# EAGLE design BaseStation_ver_20 (EAGLE 5.11)

## Sheet 1 of 2
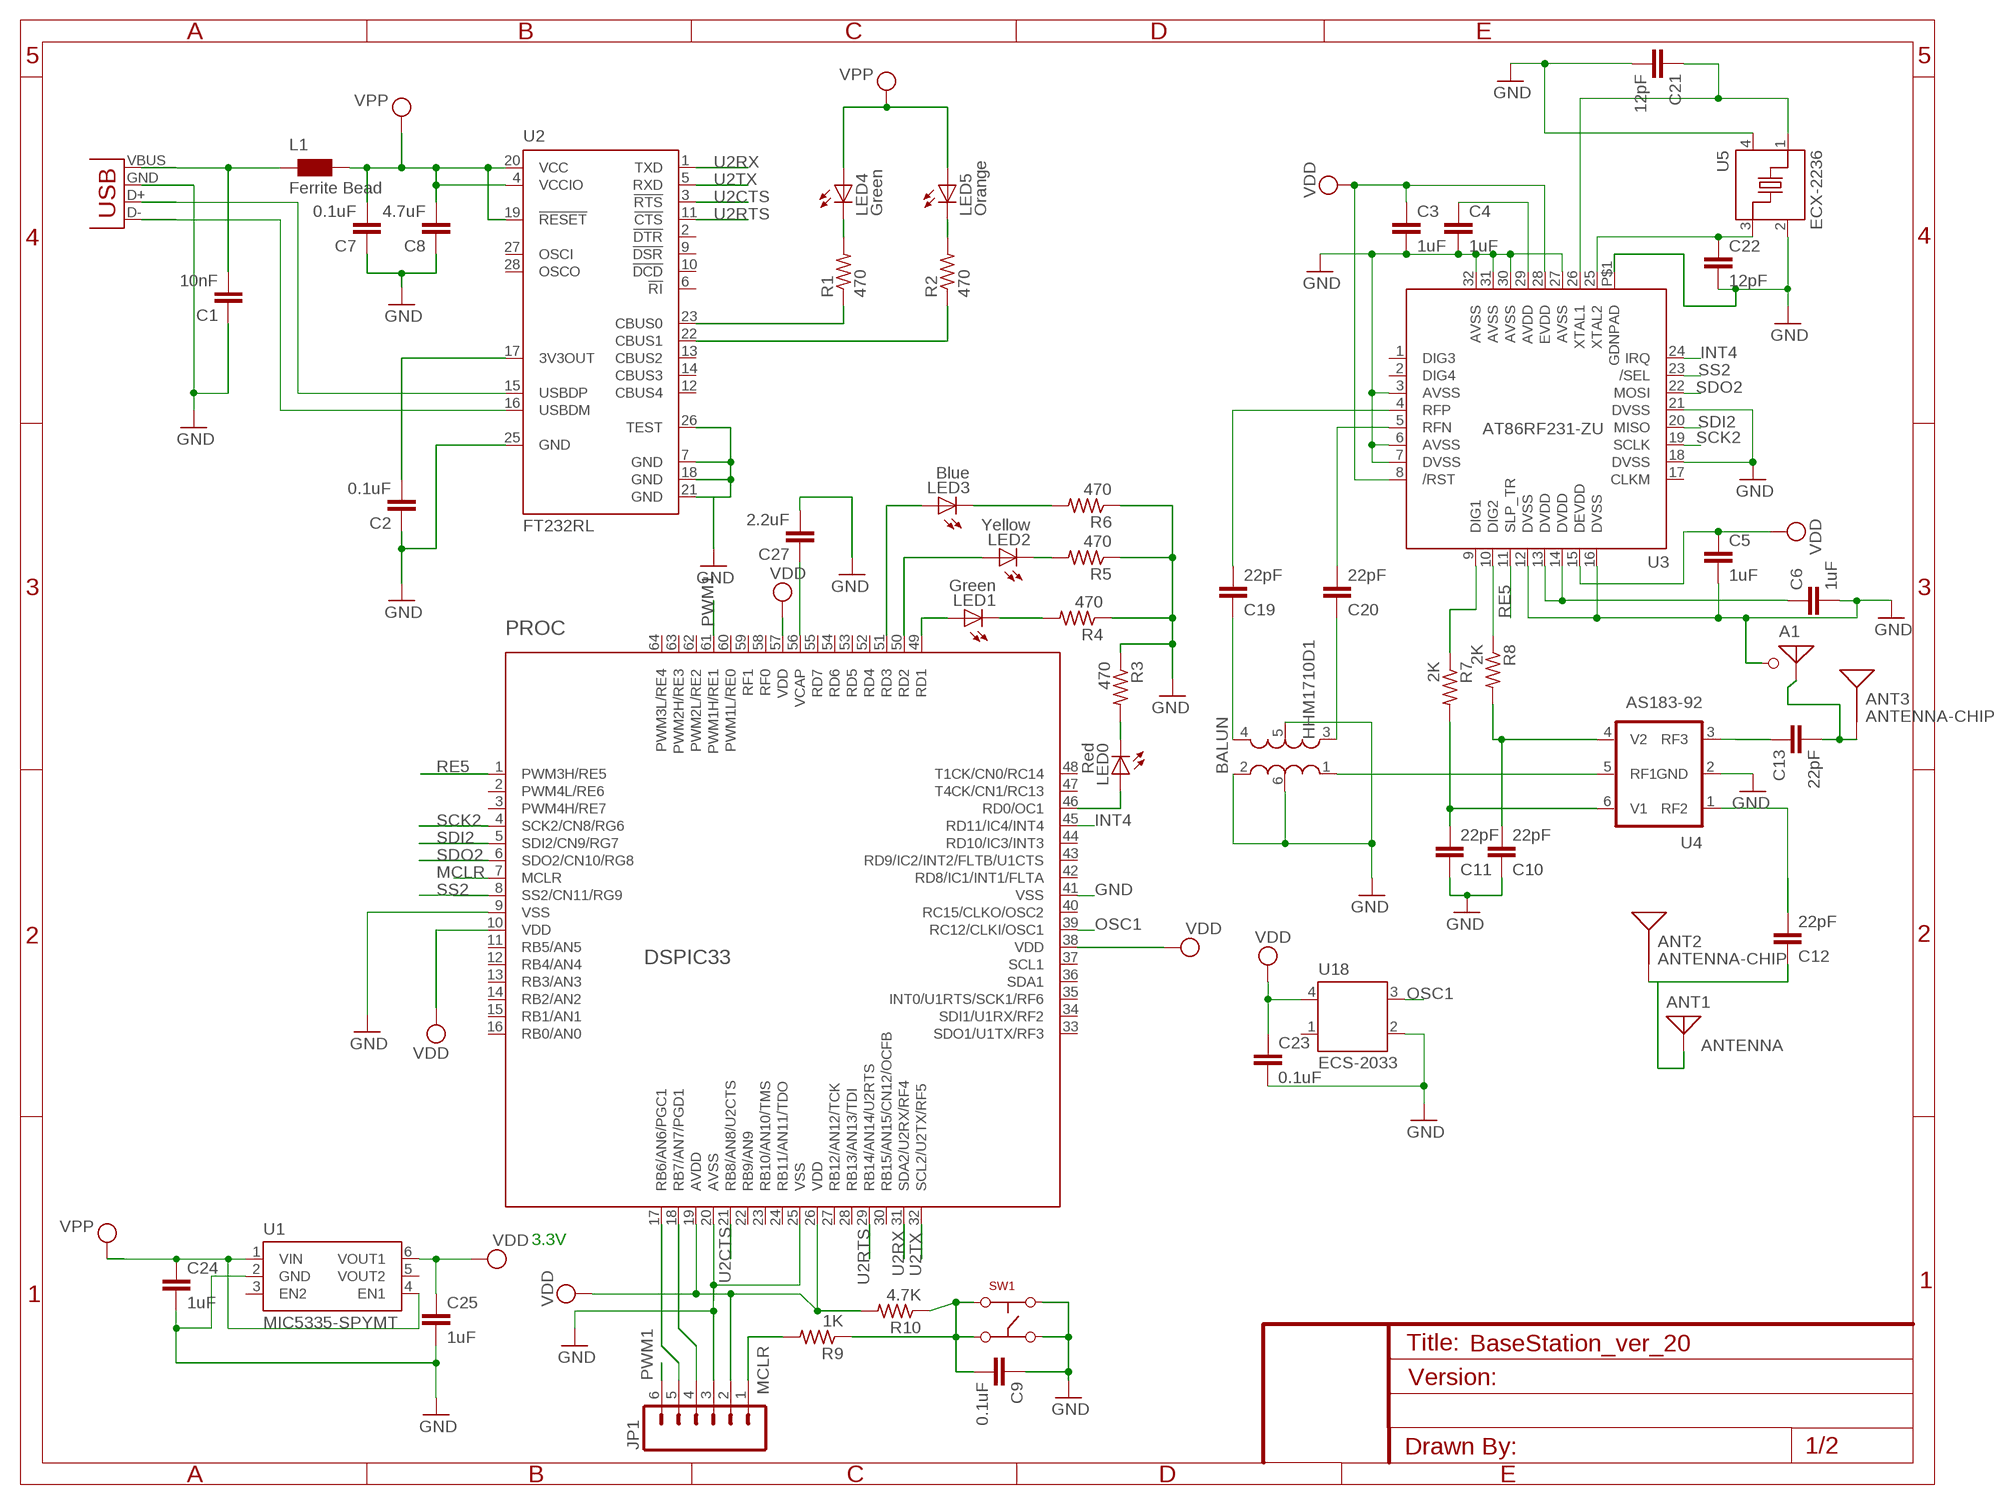
[diagram p0: schematic, sheet 1]

### Parts
A1  ANTENNA-U.FL  [U-FL]
ANT1  ANTENNA  [ANTENNA_PAD]
ANT2  ANTENNA-CHIP  [ANTENNA-CHIP]
ANT3  ANTENNA-CHIP  [ANTENNA-CHIP]
BALUN  HHM1710D1  BALUNA  [BALUN]
C1  10nF  CAP0402-CAP  [0402-CAP]
C2  0.1uF  CAP0402-CAP  [0402-CAP]
C3  1uF  CAP0402-CAP  [0402-CAP]
C4  1uF  CAP0402-CAP  [0402-CAP]
C5  1uF  CAP0402-CAP  [0402-CAP]
C6  1uF  CAP0402-CAP  [0402-CAP]
C7  0.1uF  CAP0402-CAP  [0402-CAP]
C8  4.7uF  CAP0402-CAP  [0402-CAP]
C9  0.1uF  CAP0402-CAP  [0402-CAP]
C10  22pF  CAP0402-CAP  [0402-CAP]
C11  22pF  CAP0402-CAP  [0402-CAP]
C12  22pF  CAP0402-CAP  [0402-CAP]
C13  22pF  CAP0402-CAP  [0402-CAP]
C19  22pF  CAP0402-CAP  [0402-CAP]
C20  22pF  CAP0402-CAP  [0402-CAP]
C21  12pF  CAP0402-CAP  [0402-CAP]
C22  12pF  CAP0402-CAP  [0402-CAP]
C23  0.1uF  CAP0402-CAP  [0402-CAP]
C24  1uF  CAP0402-CAP  [0402-CAP]
C25  1uF  CAP0402-CAP  [0402-CAP]
C27  2.2uF  CAP0402-CAP  [0402-CAP]
JP1  M06POLAR  [MOLEX-1X6]
L1  Ferrite Bead  WE-CBF_0805  [0805]
LED0  Red  LEDCHIP-LED0603  [CHIP-LED0603]
LED1  Green  LEDCHIP-LED0603  [CHIP-LED0603]
LED2  Yellow  LEDCHIP-LED0603  [CHIP-LED0603]
LED3  Blue  LEDCHIP-LED0603  [CHIP-LED0603]
LED4  Green  LEDCHIP-LED0603  [CHIP-LED0603]
LED5  Orange  LEDCHIP-LED0603  [CHIP-LED0603]
PROC  DSPIC33  DSPIC33FJ128MC706-I/PT  [TQFP64]
R1  470  R-US_R0402  [R0402]
R2  470  R-US_R0402  [R0402]
R3  470  R-US_R0402  [R0402]
R4  470  R-US_R0402  [R0402]
R5  470  R-US_R0402  [R0402]
R6  470  R-US_R0402  [R0402]
R7  2K  R-US_R0402  [R0402]
R8  2K  R-US_R0402  [R0402]
R9  1K  R-US_R0402  [R0402]
R10  4.7K  R-US_R0402  [R0402]
SW1  SWITCH-4TERMINAL  [PUSHBUTTON-SMD-4.7X3.5MM]
U1  MIC5335-SPYMT  MIC5320-JGYML  [MLF-6]
U2  FT232RL  [SSOP28]
U3  AT86RF231-ZU  [QFN-32]
U4  AS183-92  [SC-70-6]
U5  ECX-2236  CRYSTALS  [CRYSTAL-SMD]
U18  ECS-2033  OSCILLATORS  [OSCILLATOR-SMD]
X2  USB-A-H  [USB-A-H]

### Nets
ANT1: ANT1.P$1 ANT2.SIG(SIGNAL) C12.1
GND [sup]: A1.GND1(GND) BALUN.2(RFGND) BALUN.5(GND) BALUN.6(NC) C1.1 C2.1 C3.2 C4.2 C5.2 C6.2 C7.1 C8.1 C9.1 C10.1 C11.1 C21.2 C22.2 C23.2 C24.2 C25.2 C27.2 JP1.3 PROC.9(VSS) PROC.20(AVSS) PROC.25(VSS) PROC.41(VSS) R3.1 R4.1 R5.1 R6.1 SW1.1 SW1.2 U1.2(GND) U2.7(GND) U2.18(GND) U2.21(GND) U2.25(GND) U2.26(TEST) U3.3(AVSS) U3.6(AVSS) U3.7(DVSS) U3.12(DVSS) U3.16(DVSS) U3.18(DVSS) U3.21(DVSS) U3.27(AVSS) U3.30(AVSS) U3.31(AVSS) U3.32(AVSS) U3.P$1(GDNPAD) U4.2(GND) U5.2(GND) U5.4(GND) U18.2(GND) X2.GND(VBUS)
INT4: PROC.45(RD11/IC4/INT4) U3.24(IRQ)
MCLR: JP1.1 PROC.7(MCLR) R9.2
N$1: C27.1 PROC.56(VCAP)
N$2: C1.2 L1.1 X2.VBUS(GND)
N$3: LED3.C R6.2
N$4: R1.1 U2.23(CBUS0)
N$6: C10.2 R8.2 U4.4(V2)
N$7: LED1.C R4.2
N$8: JP1.5 PROC.17(RB6/AN6/PGC1)
N$9: A1.SIG ANT3.SIG(SIGNAL) C13.2
N$10: R2.1 U2.22(CBUS1)
N$11: LED1.A PROC.49(RD1)
N$12: LED4.C R1.2
N$13: R8.1 U3.10(DIG2)
N$14: U2.16(USBDM) X2.D-(D+)
N$15: U2.15(USBDP) X2.D+(D-)
N$16: C11.2 R7.2 U4.6(V1)
N$17: R7.1 U3.9(DIG1)
N$18: C13.1 U4.3(RF3)
N$19: C12.2 U4.1(RF2)
N$20: LED3.A PROC.51(RD3)
N$21: JP1.4 PROC.18(RB7/AN7/PGD1)
N$22: LED2.A PROC.50(RD2)
N$23: C4.1 U3.29(AVDD)
N$24: LED5.C R2.2
N$25: C9.2 R9.1 R10.1 SW1.3 SW1.4
N$26: LED2.C R5.2
N$27: C2.2 U2.17(3V3OUT)
N$28: C6.1 U3.13(DVDD) U3.14(DVDD)
N$29: LED0.A PROC.46(RD0/OC1)
N$30: LED0.C R3.2
N$39: BALUN.1(UNBAL) U4.5(RF1)
N$43: BALUN.4(BAL4) C19.1
N$46: BALUN.3(BAL3) C20.1
N$47: C19.2 U3.4(RFP)
N$49: C20.2 U3.5(RFN)
N$50: C22.1 U3.25(XTAL2) U5.3(IN/OUT)
N$51: C21.1 U3.26(XTAL1) U5.1(IN/OUT)
OSC1: PROC.39(RC12/CLKI/OSC1) U18.3(OUT)
PWM1: JP1.6 PROC.61(PWM1H/RE1)
RE5: PROC.1(PWM3H/RE5) U3.11(SLP_TR)
SCK2: PROC.4(SCK2/CN8/RG6) U3.19(SCLK)
SDI2: PROC.5(SDI2/CN9/RG7) U3.20(MISO)
SDO2: PROC.6(SDO2/CN10/RG8) U3.22(MOSI)
SS2: PROC.8(SS2/CN11/RG9) U3.23(/SEL)
U2CTS: PROC.21(RB8/AN8/U2CTS) U2.3(!RTS)
U2RTS: PROC.29(RB14/AN14/U2RTS) U2.11(!CTS)
U2RX: PROC.31(SDA2/U2RX/RF4) U2.1(TXD)
U2TX: PROC.32(SCL2/U2TX/RF5) U2.5(RXD)
VDD: C3.1 C5.1 C23.1 C25.1 JP1.2 PROC.10(VDD) PROC.19(AVDD) PROC.26(VDD) PROC.38(VDD) PROC.57(VDD) R10.2 U1.6(VOUT1) U3.8(/RST) U3.15(DEVDD) U3.28(EVDD) U18.4(VDD)
VPP: C7.2 C8.2 C24.1 L1.2 LED4.A LED5.A U1.1(VIN) U1.4(EN1) U2.4(VCCIO) U2.19(!RESET) U2.20(VCC)
Unconnected: PROC.2(PWM4L/RE6) PROC.3(PWM4H/RE7) PROC.11(RB5/AN5) PROC.12(RB4/AN4) PROC.13(RB3/AN3) PROC.14(RB2/AN2) PROC.15(RB1/AN1) PROC.16(RB0/AN0) PROC.22(RB9/AN9) PROC.23(RB10/AN10/TMS) PROC.24(RB11/AN11/TDO) PROC.27(RB12/AN12/TCK) PROC.28(RB13/AN13/TDI) PROC.30(RB15/AN15/CN12/OCFB) PROC.33(SDO1/U1TX/RF3) PROC.34(SDI1/U1RX/RF2) PROC.35(INT0/U1RTS/SCK1/RF6) PROC.36(SDA1) PROC.37(SCL1) PROC.40(RC15/CLKO/OSC2) PROC.42(RD8/IC1/INT1/FLTA) PROC.43(RD9/IC2/INT2/FLTB/U1CTS) PROC.44(RD10/IC3/INT3) PROC.47(T4CK/CN1/RC13) PROC.48(T1CK/CN0/RC14) PROC.52(RD4) PROC.53(RD5) PROC.54(RD6) PROC.55(RD7) PROC.58(RF0) PROC.59(RF1) PROC.60(PWM1L/RE0) PROC.62(PWM2L/RE2) PROC.63(PWM2H/RE3) PROC.64(PWM3L/RE4) U1.3(EN2) U1.5(VOUT2) U2.2(!DTR) U2.6(!RI) U2.9(!DSR) U2.10(!DCD) U2.12(CBUS4) U2.13(CBUS2) U2.14(CBUS3) U2.27(OSCI) U2.28(OSCO) U3.1(DIG3) U3.2(DIG4) U3.17(CLKM) U18.1(NC)

### Notes on the sheet
- 3.3V

## Sheet 2 of 2

## Library data of the parts
A1 = stan:ANTENNA-U.FL
ANT1 = stan:ANTENNA
ANT2 ANT3 = stan:ANTENNA-CHIP
BALUN = stan:BALUN
C1-C13 C19-C25 C27 = SparkFun:CAP: Capacitor Standard 0603 ceramic capacitor, and 0.1" leaded capacitor.
JP1 = SparkFun:M06: Header 6 Standard 6-pin 0.1" header. Use with straight break away headers (SKU : PRT-00116), right angle break away headers (PRT-00553), swiss pins (PRT-00743), machine pins (PRT-00117), and female headers (PRT-00115). Molex polarized connector foot print use with SKU : PRT-08094 with associated crimp pins and housings. NOTES ON THE VARIANTS LOCK and LOCK_LONGPADS... This footprint was designed to help hold the alignment of a through-hole component (i.e. 6-pin header) while soldering it into place. You may notice that each hole has been shifted either up or down by 0.005 of an inch from it's more standard position (which is a perfectly straight line). This slight alteration caused the pins (the squares in the middle) to touch the edges of the holes. Because they are alternating, it causes a "brace" to hold the component in place. 0.005 has proven to be the perfect amount of "off-center" position when using our standard breakaway headers. Although looks a little odd when you look at the bare footprint, once you have a header in there, the alteration is very hard to notice. Also, if you push a header all the way into place, it is covered up entirely on the bottom side. This idea of altering the position of holes to aid alignment will be further integrated into the Sparkfun Library for other footprints. It can help hold any component with 3 or more connection pins.
L1 = wuerth-elektronik:WE-CBF: SMD EMI Suppression Ferrite Beads - excellent anti-EMI properties - low DCR - impedances till 3000 ohms - rated current up to 6 A
LED0 LED1-LED5 = led:LED: LED OSRAM: - CHIPLED LG R971, LG N971, LY N971, LG Q971, LY Q971, LO R971, LY R971 LH N974, LH R974 LS Q976, LO Q976, LY Q976 LO Q996 - Hyper CHIPLED LW Q18S LB Q993, LB Q99A, LB R99A - SideLED LS A670, LO A670, LY A670, LG A670, LP A670 LB A673, LV A673, LT A673, LW A673 LH A674 LY A675 LS A676, LA A676, LO A676, LY A676, LW A676 LS A679, LY A679, LG A679 - Hyper Micro SIDELED® LS Y876, LA Y876, LO Y876, LY Y876 LT Y87S - SmartLED LW L88C, LW L88S LB L89C, LB L89S, LG L890 LS L89K, LO L89K, LY L89K LS L896, LA L896, LO L896, LY L896 - TOPLED LS T670, LO T670, LY T670, LG T670, LP T670 LSG T670, LSP T670, LSY T670, LOP T670, LYG T670 LG T671, LOG T671, LSG T671 LB T673, LV T673, LT T673, LW T673 LH T674 LS T676, LA T676, LO T676, LY T676, LB T676, LH T676, LSB T676, LW T676 LB T67C, LV T67C, LT T67C, LS T67K, LO T67K, LY T67K, LW E67C LS E67B, LA E67B, LO E67B, LY E67B, LB E67C, LV E67C, LT E67C LW T67C LS T679, LY T679, LG T679 LS T770, LO T770, LY T770, LG T770, LP T770 LB T773, LV T773, LT T773, LW T773 LH T774 LS E675, LA E675, LY E675, LS T675 LS T776, LA T776, LO T776, LY T776, LB T776 LHGB T686 LT T68C, LB T68C - Hyper Mini TOPLED® LB M676 - Mini TOPLED Santana® LG M470 LS M47K, LO M47K, LY M47K Source: http://www.osram.convergy.de LUXEON: - LUMILED® LXK2-PW12-R00, LXK2-PW12-S00, LXK2-PW14-U00, LXK2-PW14-V00 LXK2-PM12-R00, LXK2-PM12-S00, LXK2-PM14-U00 LXK2-PE12-Q00, LXK2-PE12-R00, LXK2-PE12-S00, LXK2-PE14-T00, LXK2-PE14-U00 LXK2-PB12-K00, LXK2-PB12-L00, LXK2-PB12-M00, LXK2-PB14-N00, LXK2-PB14-P00, LXK2-PB14-Q00 LXK2-PR12-L00, LXK2-PR12-M00, LXK2-PR14-Q00, LXK2-PR14-R00 LXK2-PD12-Q00, LXK2-PD12-R00, LXK2-PD12-S00 LXK2-PH12-R00, LXK2-PH12-S00 LXK2-PL12-P00, LXK2-PL12-Q00, LXK2-PL12-R00 Source: www.luxeon.com KINGBRIGHT: KA-3528ASYC Source: www.kingbright.com
PROC = stan:DSPIC33FJ128MC706: Microchip dsPIC33FJ128MC706
R1-R10 = rcl:R-US_: RESISTOR, American symbol
SW1 = stan:SWITCH-4TERMINAL
U1 = stan:MIC5320: MIC5320 High Performance Dual 150mA Voltage Regulator Package: NOT VERIFIED
U2 = ftdichip:FT232R: Source: http://www.ftdichip.com/Documents/DataSheets/DS_FT232R_v104.pdf
U3 = stan:AT86RF231: Atmel 2.4GHz transceiver for Zigbee
U4 = stan:AS183-92
U5 = stan:CRYSTAL
U18 = stan:OSCILLATOR
X2 = SparkFun:USB: USB Connectors USB-B-PTH is fully proven SKU : PRT-00139 USB-miniB is fully proven SKU : PRT-00587 USB-A-PCB is untested. USB-A-H is throughly reviewed, but untested. Spark Fun Electronics SKU : PRT-00437 USB-B-SMT is throughly reviewed, but untested. Needs silkscreen touching up. USB-A-S has not been used/tested USB-MB-H has not been used/tested

## Net classes
1 sup: width 0.254 mm

## Board
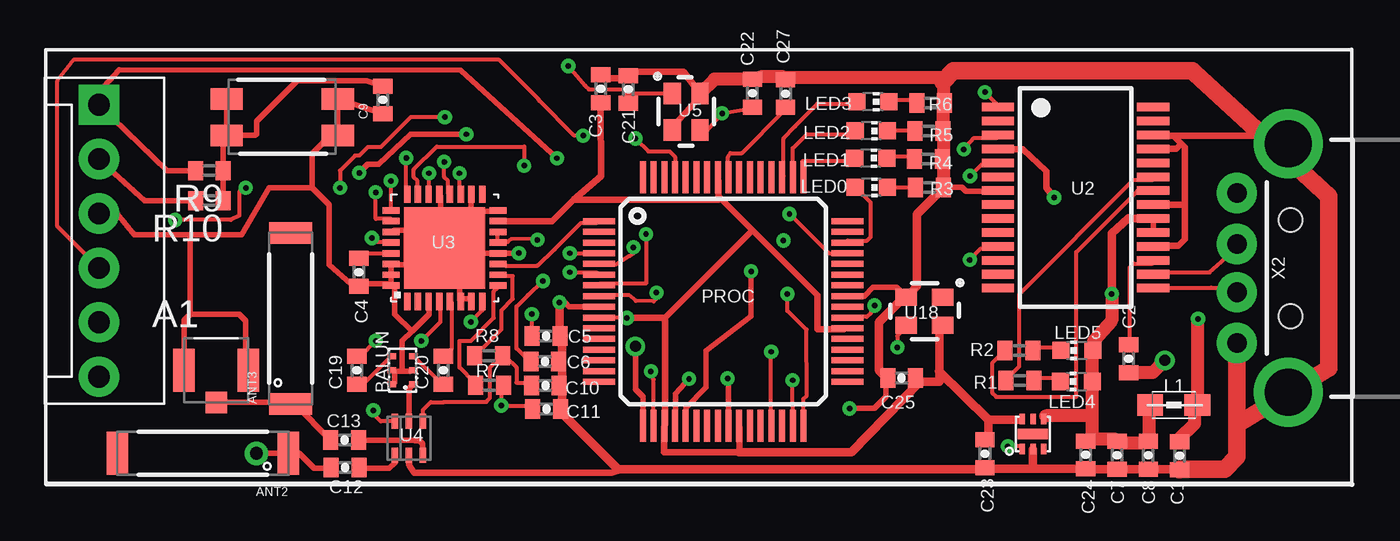
[diagram p1: board, top side]
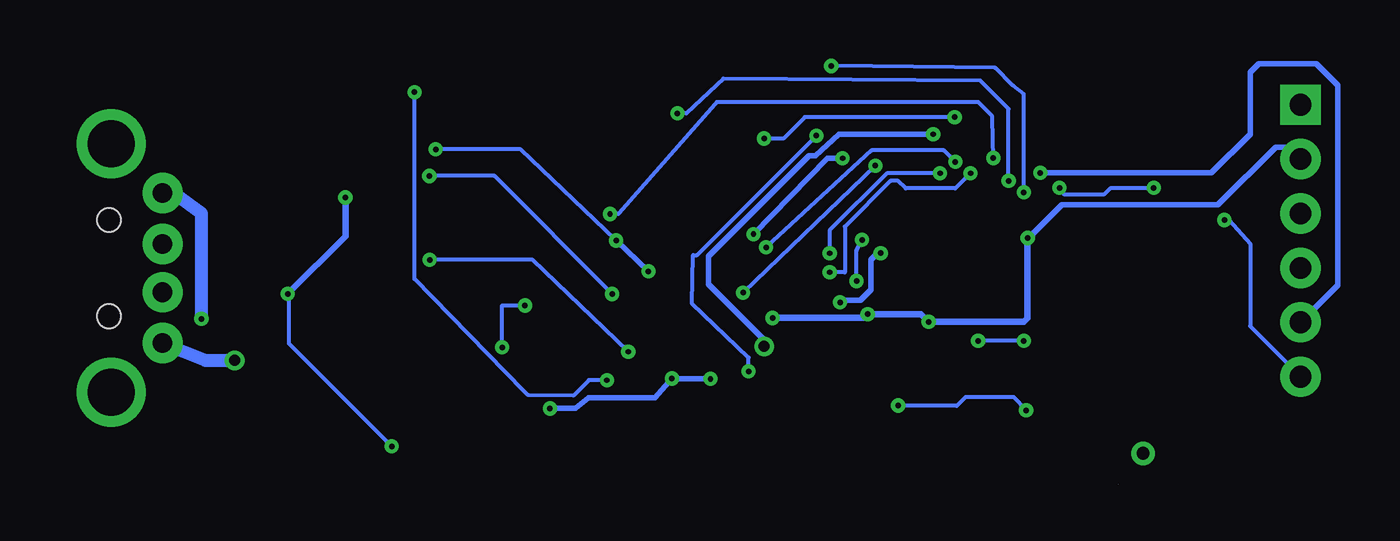
[diagram p2: board, bottom side, seen from below]

Size 0.01 x 0 mm. Coordinates in mm from the lower left corner, seen from the top.
Outline: 0.01,0 0,0
Copper layers (1*16): Top 0.035mm / dielectric 1.5mm / Bottom 0.035mm
Design rules "default *": minimum track width 7mil, minimum drill 10mil, track to track 6mil, track to pad 6mil, pad to pad 6mil, via to via 6mil, smd to smd 6mil, copper to edge 6mil, drill to drill 6mil, minimum pad ring 10mil, minimum via ring 8mil, stop-mask expansion 4mil, vias tented up to drill 27mil, thermal gap 10mil

### Footprints (pad centres in the part's own frame; a part is rotated, then mirrored left to right if it is on the bottom)
U-FL = smd 1 x 2: GND1 -1.5,0; GND2 1.5,0 | smd 1 x 1: SIG 0,-1.5
ANTENNA_PAD = drill 0.6 round: P$1 0,0
ANTENNA-CHIP = smd 1 x 2: NC 4,0; SIG -4,0
BALUN = smd 0.27 x 0.4: 1 -0.7,-0.5; 2 -0.05,-0.5; 3 0.6,-0.5; 4 0.6,0.5; 5 -0.05,0.5; 6 -0.7,0.5
0402-CAP = smd 0.7 x 0.9: 1 -0.65,0; 2 0.65,0
MOLEX-1X6 = drill 1.016 pad 1.88 square: 1 0,0 | drill 1.016 pad 1.88 round: 2 2.54,0; 3 5.08,0; 4 7.62,0; 5 10.16,0; 6 12.7,0
0805 = smd 1.2 x 1: 1 -1.1,0; 2 1.1,0
CHIP-LED0603 = smd 0.8 x 0.8: A 0,-0.75; C 0,0.75
TQFP64 = smd 1.5 x 0.28: 1 -5.8,3.75; 2 -5.8,3.25; 3 -5.8,2.75; 4 -5.8,2.25; 5 -5.8,1.75; 6 -5.8,1.25; 7 -5.8,0.75; 8 -5.8,0.25; 9 -5.8,-0.25; 10 -5.8,-0.75; 11 -5.8,-1.25; 12 -5.8,-1.75; 13 -5.8,-2.25; 14 -5.8,-2.75; 15 -5.8,-3.25; 16 -5.8,-3.75; 33 5.8,-3.75; 34 5.8,-3.25; 35 5.8,-2.75; 36 5.8,-2.25; 37 5.8,-1.75; 38 5.8,-1.25; 39 5.8,-0.75; 40 5.8,-0.25; 41 5.8,0.25; 42 5.8,0.75; 43 5.8,1.25; 44 5.8,1.75; 45 5.8,2.25; 46 5.8,2.75; 47 5.8,3.25; 48 5.8,3.75 | smd 0.28 x 1.5: 17 -3.75,-5.8; 18 -3.25,-5.8; 19 -2.75,-5.8; 20 -2.25,-5.8; 21 -1.75,-5.8; 22 -1.25,-5.8; 23 -0.75,-5.8; 24 -0.25,-5.8; 25 0.25,-5.8; 26 0.75,-5.8; 27 1.25,-5.8; 28 1.75,-5.8; 29 2.25,-5.8; 30 2.75,-5.8; 31 3.25,-5.8; 32 3.75,-5.8; 49 3.75,5.8; 50 3.25,5.8; 51 2.75,5.8; 52 2.25,5.8; 53 1.75,5.8; 54 1.25,5.8; 55 0.75,5.8; 56 0.25,5.8; 57 -0.25,5.8; 58 -0.75,5.8; 59 -1.25,5.8; 60 -1.75,5.8; 61 -2.25,5.8; 62 -2.75,5.8; 63 -3.25,5.8; 64 -3.75,5.8
R0402 = smd 0.7 x 0.9: 1 -0.65,0; 2 0.65,0
PUSHBUTTON-SMD-4.7X3.5MM = smd 1.5 x 1: 1 2.6,0.85; 2 2.6,-0.85; 3 -2.6,0.85; 4 -2.6,-0.85
MLF-6 = smd 0.25 x 0.5: 1 -0.5,-0.7; 2 0,-0.7; 3 0.5,-0.7; 4 0.5,0.7; 5 0,0.7; 6 -0.5,0.7 | smd 1.4 x 0.5: P$1 0,0
SSOP28 = smd 0.4 x 1.5: 1 -4.225,-3.625; 2 -3.575,-3.625; 3 -2.925,-3.625; 4 -2.275,-3.625; 5 -1.625,-3.625; 6 -0.975,-3.625; 7 -0.325,-3.625; 8 0.325,-3.625; 9 0.975,-3.625; 10 1.625,-3.625; 11 2.275,-3.625; 12 2.925,-3.625; 13 3.575,-3.625; 14 4.225,-3.625; 15 4.225,3.625; 16 3.575,3.625; 17 2.925,3.625; 18 2.275,3.625; 19 1.625,3.625; 20 0.975,3.625; 21 0.325,3.625; 22 -0.325,3.625; 23 -0.975,3.625; 24 -1.625,3.625; 25 -2.275,3.625; 26 -2.925,3.625; 27 -3.575,3.625; 28 -4.225,3.625
QFN-32 = smd 0.8 x 0.3: 1 -2.5,1.75; 2 -2.5,1.25; 3 -2.5,0.75; 4 -2.5,0.25; 5 -2.5,-0.25; 6 -2.5,-0.75; 7 -2.5,-1.25; 8 -2.5,-1.75; 17 2.5,-1.75; 18 2.5,-1.25; 19 2.5,-0.75; 20 2.5,-0.25; 21 2.5,0.25; 22 2.5,0.75; 23 2.5,1.25; 24 2.5,1.75 | smd 0.3 x 0.8: 9 -1.75,-2.5; 10 -1.25,-2.5; 11 -0.75,-2.5; 12 -0.25,-2.5; 13 0.25,-2.5; 14 0.75,-2.5; 15 1.25,-2.5; 16 1.75,-2.5; 25 1.75,2.5; 26 1.25,2.5; 27 0.75,2.5; 28 0.25,2.5; 29 -0.25,2.5; 30 -0.75,2.5; 31 -1.25,2.5; 32 -1.75,2.5 | smd 3.8 x 3.8: P$1 0,0.001
SC-70-6 = smd 0.3 x 0.7: 1 -0.65,-0.8; 2 0,-0.8; 3 0.65,-0.8; 4 0.65,0.8; 5 0,0.8; 6 -0.65,0.8
CRYSTAL-SMD = smd 1 x 0.8: 1 -0.85,-0.65; 2 0.85,-0.65; 3 0.85,0.65; 4 -0.85,0.65
OSCILLATOR-SMD = smd 1 x 0.8: 1 -0.85,-0.65; 2 0.85,-0.65; 3 0.85,0.65; 4 -0.85,0.65
USB-A-H = drill 0.914 pad 1.88 round: D+ 2.4,1.127; D- 2.4,-1.127; GND 2.4,3.5; VBUS 2.4,-3.5 | drill 2.2 round: GND2 0,-5.8; GND3 0,5.8 | hole 1.1: -0.1,2.25; -0.1,-2.25

### Placement (x,y rotation side)
A1  -3.03,5.33 0 top  (outside the outline)
ANT1  -1.15,1.45 0 top
ANT2  -3.65,1.45 180 top
ANT3  0.45,7.75 90 top  (outside the outline)
BALUN  5.67,5.38 90 top  (outside the outline)
C1  41.96,1.34 90 top  (outside the outline)
C2  39.58,5.87 90 top  (outside the outline)
C3  14.92,18.48 90 top  (outside the outline)
C4  3.63,9.91 270 top  (outside the outline)
C5  12.37,6.93 0 top  (outside the outline)
C6  12.32,5.74 0 top  (outside the outline)
C7  39.05,1.37 90 top  (outside the outline)
C8  40.5,1.36 90 top  (outside the outline)
C9  4.75,17.95 90 top  (outside the outline)
C10  12.34,4.63 180 top  (outside the outline)
C11  12.39,3.53 180 top  (outside the outline)
C12  2.99,0.8 0 top
C13  2.97,2.07 180 top
C19  3.54,5.33 90 top  (outside the outline)
C20  7.58,5.33 90 top  (outside the outline)
C21  16.21,18.44 90 top  (outside the outline)
C22  22.01,18.27 90 top  (outside the outline)
C23  32.87,1.44 270 top  (outside the outline)
C24  37.58,1.38 270 top  (outside the outline)
C25  28.98,4.97 180 top  (outside the outline)
C27  23.56,18.25 90 top  (outside the outline)
JP1  -8.51,17.73 270 top  (outside the outline)
L1  41.69,3.71 180 top  (outside the outline)
LED0  27.56,13.87 270 top  (outside the outline)
LED1  27.54,15.23 270 top  (outside the outline)
LED2  27.56,16.51 270 top  (outside the outline)
LED3  27.64,17.87 270 top  (outside the outline)
LED4  37.14,4.81 90 top  (outside the outline)
LED5  37.16,6.26 90 top  (outside the outline)
PROC  20.65,8.54 0 top  (outside the outline)
R1  34.5,4.85 0 top  (outside the outline)
R2  34.46,6.25 0 top  (outside the outline)
R3  30.28,13.87 180 top  (outside the outline)
R4  30.23,15.2 180 top  (outside the outline)
R5  30.25,16.5 180 top  (outside the outline)
R6  30.34,17.81 180 top  (outside the outline)
R7  9.73,4.63 0 top  (outside the outline)
R8  9.7,6.01 0 top  (outside the outline)
R9  -3.35,14.65 180 top  (outside the outline)
R10  -3.35,13.25 180 top  (outside the outline)
SW1  0.05,17.15 0 top  (outside the outline)
U1  35.11,2.35 0 top  (outside the outline)
U2  37.1,13.39 270 top  (outside the outline)
U3  7.64,11.04 90 top  (outside the outline)
U4  5.97,2.16 0 top  (outside the outline)
U5  18.92,17.41 270 top  (outside the outline)
U18  30.05,8.09 180 top  (outside the outline)
X2  47.04,10.1 180 top  (outside the outline)

### Tracks (layer width: path | path; a pad name or v marks a point on that pad's centre or on a via)
ANT1
  Top 0.254: ANT1.P$1 ANT2.SIG 0.85,1.45 1.55,0.75 2.3,0.75 C12.1
GND  (via drill 0.25, 0.51)
  Top 0.254: 40.54,0.71 C8.1 40.36,0.71 | 41.78,0.71 C1.1 | C7.1 39.12,0.71 | C24.2 | U18.2 29.16,8.81 | 28.27,4.98 C25.2 28.25,4.8 28.25,4.09 27.72,3.56 27.36,3.56 v26.55,3.55 | 30.94,15.29 R4.1 | R5.1 30.94,16.36 | 30.76,13.69 30.76,13.87 R3.1 31.09,13.87 31.81,13.87 31.98,13.69 33.41,13.69 U2.7 | 29.34,8.89 U18.2 | PROC.41 27.24,8.79 27.65,9.2 28.74,9.2 U18.2 | 16.21,19.28 C21.2 | 19.38,17.89 19.48,18.15 U5.4 | 18.31,16.72 U5.2 | C21.2 16.08,19.02 | 15.01,19.02 C3.2 15.09,18.97 | 22.4,19.02 C22.2 | 23.47,19.02 C27.2 23.65,19 | 30.9,17.72 R6.1 30.94,17.96 | 30.94,19 30.94,18.8 30.91,18.8 | v19.05,4.93 18.42,4.25 PROC.20 | PROC.25 20.9,3.39 20.9,4.9 v20.85,4.95 | C21.2 15.98,18.97 | 13.13,5.64 C6.2 13.13,5.82 | 13.13,4.75 C10.1 13.13,4.57 | C5.2 13.13,6.88 | 5.31,5.28 5.31,4.75 BALUN.6 | 5.66,5.28 5.31,5.28 | 5.66,5.28 6.02,5.28 BALUN.2 | 5.31,5.28 BALUN.5 | 5.13,9.37 5.13,9.73 U3.31 5.13,9.91 5.13,10.26 U3.30 5.31,10.26 5.84,10.26 5.84,11.86 | 5.66,5.28 5.66,6.71 6.11,7.15 | 6.11,7.15 6.91,7.95 6.91,8.48 U3.3 | 5.13,9.37 3.71,9.37 C4.2 | 5.13,9.37 U3.32 5.31,9.2 5.31,7.95 6.11,7.15 | 13.13,3.33 13.13,3.68 C11.1 12.95,3.33 | 32.79,0.71 C23.2 | C4.2 3.35,9.2 | v11.09,10.79 U3.12 10.11,10.8 8.33,10.8 | v13,8.5 13.25,8.5 13.45,8.3 PROC.9 | U3.7 8.86,8.66 8.51,8.66 U3.6 8.33,8.66 8.33,10.8 | 7.44,11.86 7.62,11.86 7.62,11.68 | 5.84,11.86 7.44,11.86 | 5.84,11.86 5.31,11.86 U3.27 | 7.62,11.68 7.62,11.15 U3.P$1 | 7.44,11.86 7.44,13.46 U3.21 | 7.44,11.86 U3.P$1 | 7.62,11.68 8.86,12.93 8.86,13.46 U3.18 | U3.P$1 7.62,11.68 | U3.16 10.11,12.75 8.86,12.75 U3.P$1 | 8.33,10.8 8.33,11.86 U3.P$1 | 5.84,11.86 U3.P$1 | U3.P$1 8.33,10.8 | 40.74,16.29 U2.26 | C4.2 3.53,9.37 3.24,9.36 2.25,10.25 2.24,13.06 1.45,13.85
  Top 0.254: C9.1 SW1.1 SW1.2 2.65,16.65 1.45,15.45 1.45,13.85 | JP1.3 -7.65,12.65 -6.85,11.65 -4.25,11.65 | -4.25,11.65 -1.85,11.65 -0.55,13.85 1.45,13.85 | A1.GND1 -4.53,7.67 -4.25,7.95 | -1.65,5.35 -1.65,7.65 -1.95,7.95 -4.25,7.95 | -4.25,7.95 -4.25,11.65
  Top 0.305: C23.2 32.93,0.73 | 19.38,17.89 18.31,16.72 | 15.98,18.97 15.09,18.97 | 16.21,19.28 18.8,19.28 U5.4 | 41.67,16.29 45.69,16.29 48.92,13.46 | 41.67,16.29 40.74,16.29 | 41.67,16.29 42.05,15.9 | 42.05,15.9 42.2,15.75 42.2,13.1 | 42.2,13.1 42.2,11.45 41.9,11.15 40.76,11.15 U2.18 | U2.21 42.17,13.06 42.2,13.1 | U2.25 41.81,15.66 42.05,15.9 | 15.95,0.71 15.44,0.56 6.2,0.56 6.02,0.84 5.98,0.92 U4.2
  Top 0.406: 40.54,0.71 41.78,0.71 | 39.12,0.71 40.36,0.71 | C24.2 C7.1 | 35.1,0.73 C24.2 | U1.2 35.11,0.74 35.1,0.73 | 32.93,0.73 35.1,0.73 | 29.16,8.81 27.92,7.57 27.92,5.33 28.27,4.98 | 29.34,8.89 29.69,9.25 29.69,12.62 30.76,13.69 | R4.1 30.93,15.15 | 13.13,5.64 13.13,4.75 | 13.13,6.88 13.13,5.82 | 13.13,4.57 13.13,3.68 | 13.13,3.33 15.75,0.71 15.95,0.71 32.79,0.71 | v11.09,10.79 v11.1,10.8 | v13,8.5 13,6.95 C5.2
  Top 0.61: 30.94,16.36 30.94,15.29 | 23.47,19.02 22.4,19.02 | 30.9,17.72 R5.1 | 30.93,15.15 R3.1 | 30.94,19 23.65,19 | 30.94,18.8 30.94,17.96 | C22.2 20.23,18.92 U5.4 | C2.1 40.7,5.22 v41.27,5.79 | 42.68,19.2 42.55,19.31
  Top 0.813: 30.91,18.8 31.4,19.31 42.55,19.31 | 44.64,2.78 44.64,1.28 44.07,0.71 41.98,0.71 C1.1 | 44.64,2.78 X2.GND | 42.68,19.2 48.92,13.46 48.92,5.43 44.64,2.78
  Bottom 0.254: 11.25,10.8 11.55,10.5 11.55,9.1 12.05,8.6 12.9,8.6 | v19.05,4.93 20.83,4.93 v20.85,4.95 21.65,4.05 24.75,4.05 25.35,3.55 v26.55,3.55
  Bottom 0.406: v11.1,10.8 11.25,10.8 | 12.9,8.6 v13,8.5
  Bottom 0.61: v41.27,5.79 42.63,5.79 X2.GND
INT4  (via drill 0.25)
  Top 0.178: v5.84,15.24 5.84,13.64 U3.24 | v23.74,12.63 25.58,10.8 26.29,10.8 PROC.45
  Bottom 0.178: v5.84,15.24 5.89,17.07 5.89,17.19 6.55,17.85 18.75,17.85 18.85,17.75 19.53,16.97 23.35,12.63 v23.74,12.63
MCLR  (via drill 0.25)
  Top 0.178: v17.04,11.68 17.04,9.37 14.91,9.37 PROC.7
  Top 0.254: v12.89,15.23 8.37,19.33 -7.56,19.36 -8.51,18.31 JP1.1 -5.33,14.65 R9.2
  Bottom 0.254: v17.04,11.68 13.6,15.23 v12.89,15.23
N$1
  Top 0.178: C27.1 23.47,17.42 21.51,15.47 20.98,15.47 20.88,15.3 PROC.56
N$2  (via drill 0.25)
  Top 0.178: C1.2 41.96,2.13 | 42.67,3.56 L1.1 42.82,3.86
  Top 0.61: 41.96,2.13 42.67,2.85 42.67,3.56 | 42.82,3.86 v42.82,7.73
  Bottom 0.61: v42.82,7.73 42.82,12.66 44.02,13.56 X2.VBUS
N$3
  Top 0.178: LED3.C 28.43,17.96 29.67,17.96 R6.2
N$4
  Top 0.178: R1.1 33.94,4.98 34.47,5.51 34.47,8.89 39.81,14.22 40.7,14.22 U2.23
N$6
  Top 0.178: C10.2 11.53,4.75 11,4.75 11,5.46 10.46,6 R8.2 10.29,6 9.75,5.46 9.75,4.04 9.57,3.86 7.62,3.86 7.61,3.85 6.99,3.85 6.62,3.48 U4.4
N$7
  Top 0.178: LED1.C 28.43,15.29 29.49,15.29 R4.2
N$8  (via drill 0.25, 0.51)
  Top 0.254: PROC.17 16.9,4.1 16.55,4.45 v16.55,6.45 | v8.65,16.35 6.05,16.35 4.55,14.95 4.05,14.95 v3.65,14.55
  Bottom 0.254: v16.55,6.45 16.55,6.75 19.15,9.35 19.15,10.65 14.45,15.35 14.15,15.35 13.05,16.35 v8.65,16.35 | v3.65,14.55 -4.35,14.55 -6.15,16.35 -6.15,19.25 -6.55,19.65 -9.25,19.65 -10.25,18.65 -10.25,9.31 JP1.5
N$9
  Top 0.254: C13.2 0.64,3.75 ANT3.SIG 0.37,3.83 A1.SIG
N$10
  Top 0.178: R2.1 33.76,6.22 33.23,5.69 33.23,4.27 33.41,4.09 37.14,4.09 37.14,10.85 39.98,13.69 40.7,13.69 U2.22
N$11
  Top 0.178: LED1.A 26.67,15.11 24.36,15.11 24.36,14.4 PROC.49
N$12
  Top 0.178: LED4.C 36.25,4.98 35.18,4.98 R1.2
N$13
  Top 0.178: U3.10 10.29,9.73 10.82,9.73 10.82,8.66 10.29,8.13 10.29,7.24 9.22,6.17 R8.1
N$14
  Top 0.178: 40.87,9.78 U2.16 40.87,9.91 43.36,9.91 44.31,10.75 44.62,11.12 X2.D-
N$15
  Top 0.178: U2.15 40.87,9.2 43.42,9.2 44.37,9.18 X2.D+
N$16  (via drill 0.25)
  Top 0.178: v4.31,3.46 4.31,3.27 4.33,3.27 4.65,2.95 U4.6 | R7.2 10.29,4.57 v10.29,3.68 11.71,3.68 C11.2
  Bottom 0.178: v4.31,3.46 4.88,4.08 7.14,4.08 7.55,3.67 v10.29,3.68
N$17
  Top 0.178: U3.9 10.11,9.2 9.93,9.02 9.93,7.77 8.86,6.71 8.33,6.71 8.33,5.46 9.04,4.75 R7.1
N$18
  Top 0.178: 6.23,2.07 6.25,2.05 | U4.3
  Top 0.254: C13.1 6.23,2.07 | 6.25,2.05 6.46,2.05 6.62,1.89 U4.3
N$19
  Top 0.254: U4.1 5.32,1.02 5.05,0.75 3.79,0.75 C12.2
N$20
  Top 0.178: LED3.A 26.85,17.78 25.04,17.78 24.89,17.6 24,16.71 23.47,16.16 23.47,14.4 PROC.51
N$21  (via drill 0.25)
  Top 0.178: PROC.18 17.4,4.9 v17.27,5.28 | JP1.4 -10.45,12.05 -10.45,18.85 -9.65,19.85 10.15,19.85 12.02,17.98 12.06,17.91 13.69,16.28 v14.11,16.28
  Bottom 0.178: v17.27,5.28 17.27,5.92 19.91,8.43 19.86,10.71 19.69,10.71 v14.11,16.28
N$22
  Top 0.178: LED2.A 26.67,16.36 24.55,16.36 23.9,15.7 PROC.50
N$23
  Top 0.178: U3.29 3.71,10.8 3.71,10.62 C4.1
N$24
  Top 0.178: LED5.C 36.25,6.4 35.18,6.4 R2.2
N$25
  Top 0.254: R9.1 R10.1 -2.7,16.55 SW1.4 | SW1.4 SW1.3 | SW1.4 -1.2,16.3 -1.15,16.35 -1.15,16.95 0.75,18.85 4,18.85 C9.2
N$26
  Top 0.178: LED2.C 28.43,16.54 29.49,16.54 R5.2
N$27
  Top 0.178: C2.2 39.63,6.58 39.63,10.13 39.81,10.31 40.7,10.31 U2.17
N$28  (via drill 0.25)
  Top 0.178: U3.14 10.11,11.68 10.11,11.33 U3.13 10.59,11.33 10.59,11.34 10.75,11.45 11.92,11.48 v11.97,11.42 | v12.23,9.5 11.53,8.84 11,8.31 11,6.35 11.53,5.82 C6.1
  Bottom 0.178: v12.23,9.5 12.23,10.92 v11.97,11.42
N$29
  Top 0.178: LED0.A 26.83,13.87 27.54,13.16 27.54,11.56 27.36,11.38 26.47,11.38 PROC.46
N$30
  Top 0.178: LED0.C 28.43,13.87 29.49,13.87 R3.2
N$39
  Top 0.254: U4.5 5.97,4.48 BALUN.1
N$43
  Top 0.178: BALUN.4 5.13,6 3.71,4.57 C19.1
N$46
  Top 0.178: BALUN.3 6.2,6 7.44,4.75 C20.1
N$47  (via drill 0.25)
  Top 0.178: v6.55,6.71 7.44,7.59 7.44,8.48 U3.4 | v4.42,6.71 3.71,6 C19.2
  Bottom 0.178: v4.42,6.71 v6.55,6.71
N$49
  Top 0.178: U3.5 7.97,8.48 7.97,6.35 7.62,6 C20.2
N$50  (via drill 0.25)
  Top 0.178: v5.13,14.17 5.13,12.93 U3.25 | U5.3 19.71,16.48 19.71,16.31 v20.6,17.32 21.84,17.55 C22.1
  Bottom 0.178: v5.13,14.17 5.13,17.53 6.45,18.85 18.45,18.95 20.18,17.32 v20.6,17.32
N$51  (via drill 0.25)
  Top 0.178: 18.23,18.32 U5.1 18.11,18.26 16.15,18.26 | v4.42,13.64 4.42,12.4 5.13,12.4 U3.26 | v13.41,19.54 14.2,18.62 14.38,18.44 16.15,18.44 16.15,18.26 | 16.15,18.26 16.15,17.91 C21.1
  Bottom 0.178: v4.42,13.64 4.42,18.22 4.92,18.62 5.75,19.45 v13.41,19.54
OSC1  (via drill 0.25)
  Top 0.178: v28.78,6.4 28.78,6.93 29.14,7.29 U18.3 | v27.72,8.36 27.54,8.18 27.54,8 27.36,7.82 26.47,7.82 PROC.39
  Bottom 0.178: v28.78,6.4 28.78,8.36 v27.72,8.36
PWM1  (via drill 0.25)
  Top 0.178: PROC.61 18.4,15.3 18.15,15.55 17.15,15.55 v16.55,16.15 | v7.65,17.15 6.05,17.15 4.65,15.75 4.05,15.75 3.65,15.35 3.45,15.35 2.75,14.65 v2.75,13.85 | v-1.65,13.85 -1.85,13.85 -1.95,13.65 -1.95,12.55 -2.35,12.35 v-4.95,12.35
  Bottom 0.178: v16.55,16.15 15.65,16.15 14.65,17.15 v7.65,17.15 | v2.75,13.85 2.75,13.75 2.55,13.55 0.65,13.55 0.35,13.85 v-1.65,13.85 | v-4.95,12.35 -5.15,12.35 -6.15,11.25 -6.15,7.39 JP1.6
RE5
  Top 0.178: U3.11 10.49,10.21 11.97,10.21 12.77,10.97 14.02,12.22 14.73,12.22 PROC.1
SCK2  (via drill 0.25)
  Top 0.178: v8.33,14.53 8.33,13.64 U3.19 | v13.49,10.8 14.73,10.8 PROC.4
  Bottom 0.178: v8.33,14.53 10.82,14.53 13.49,11.86 v13.49,10.8
SDI2  (via drill 0.25)
  Top 0.178: v7.62,15.06 7.62,14.35 7.8,14.17 7.8,13.64 U3.20 | v16.45,11.07 16.48,10.8 16.28,10.67 15.62,10.26 14.91,10.26 PROC.5
  Bottom 0.178: v7.62,15.06 8.15,15.6 11.53,15.6 v16.45,11.07
SDO2  (via drill 0.25)
  Top 0.178: v6.91,14.53 6.91,13.64 U3.22 | v13.49,9.91 14.73,9.91 PROC.6
  Bottom 0.178: v6.91,14.53 7.62,13.82 9.93,13.82 10.29,14.17 10.64,14.17 12.77,12.04 12.77,9.91 v13.49,9.91
SS2  (via drill 0.25)
  Top 0.178: v11.35,14.88 11.35,15.77 7.26,15.77 6.2,14.71 6.2,14.35 6.37,14.17 6.37,13.64 U3.23 | v17.53,8.96 17.53,8.75 17.53,8.68 17.4,8.55 16.58,8.57 16.25,8.84 14.91,8.84 PROC.8
  Bottom 0.178: v11.35,14.88 v17.53,8.96
U2CTS  (via drill 0.25)
  Top 0.178: v31.88,15.65 32.36,16.18 33.43,16.18 U2.3
  Top 0.254: PROC.21 18.91,3.59 19.85,4.55 19.85,6.25 21.95,7.85 v21.95,9.95
  Bottom 0.178: v23.46,11.39 27.92,15.65 v31.88,15.65
  Bottom 0.254: v21.95,9.95 v23.46,11.39
U2RTS  (via drill 0.25)
  Top 0.178: 22.89,2.8 22.89,2.72 | 22.89,2.8 v22.89,6.2 | v32.16,10.49 32.69,11.02 33.41,11.02 U2.11 | PROC.29 22.91,2.8 22.89,2.8
  Bottom 0.178: v22.89,6.2 27.36,10.49 v32.16,10.49
U2RX  (via drill 0.25)
  Top 0.178: v32.87,18.31 33.41,17.78 U2.1 | PROC.31 v23.89,4.87
  Bottom 0.178: v23.89,4.87 24.73,4.87 25.45,4.15 27.57,4.17 27.75,4.35 32.87,9.6 v32.87,18.31
U2TX  (via drill 0.25)
  Top 0.178: v23.65,8.89 23.65,8.1 24.54,7.23 24.55,4.15 24.4,4 PROC.32 | v32.18,14.4 32.72,14.93 33.43,14.93 U2.5
  Bottom 0.178: v32.18,14.4 29.14,14.4 23.63,8.89 v23.65,8.89
VDD  (via drill 0.25)
  Top 0.178: C3.1 15.01,17.6 | 29.67,4.8 C25.1 29.84,4.8 | 30.74,7.29 U18.4 | C3.1 14.91,17.78 | 21.42,2.67 PROC.26 | 17.89,2.67 PROC.19 17.93,2.8 | v8.86,7.59 9.4,8.13 9.4,8.48 U3.8 | v11.71,7.95 11.71,7.06 C5.1 | v4.24,11.51 4.24,11.33 5.13,11.33 U3.28 | v16.15,7.77 14.91,7.77 PROC.10 | 26.29,7.24 PROC.38 | 20.42,14.17 PROC.57 | 10.29,12.3 U3.15 | 14.91,17.73 C3.1 | 34.55,3.02 U1.6 | 33.04,2.26 C23.1 | 30.74,5.28 30.73,5.28 | 20.42,13.46 20.42,13.29
  Top 0.254: R10.2 -6.37,13.25 JP1.2
  Top 0.305: 29.84,4.8 29.67,4.8 | 21.42,2.67 21.42,1.78 21.39,1.5 17.89,1.5 17.89,2.67 | v16.15,7.77 17.93,7.77 | 17.93,7.77 17.93,2.8 | 26.29,7.24 25.04,7.24 25.04,8.84 22.02,11.86 | 22.02,11.86 20.42,13.46 20.42,14.17 | 17.93,7.77 22.02,11.86 | 10.29,12.3 12.66,12.3 13.66,13.29 | 13.66,13.29 14.93,14.39 14.91,17.73 | 20.42,13.29 13.66,13.29
  Top 0.406: 30.74,7.29 30.74,5.28 30.74,4.8 29.84,4.8 26.64,1.5 21.39,1.5 | 33.04,3.02 34.55,3.02 | 33.04,3.02 33.04,2.26 | 30.73,5.28 33.04,3.02
  Bottom 0.254: v4.24,11.51 4.19,11.51 2.65,13.05 -4.65,13.05 -7.35,15.75 -8.25,15.75 -8.25,15.45 JP1.2
  Bottom 0.305: v4.24,11.51 4.25,7.75 4.4,7.59 v8.86,7.59 9.22,7.95 v11.71,7.95 11.89,7.77 v16.15,7.77
VPP  (via drill 0.25)
  Top 0.178: 40.36,1.96 C8.2 40.54,2.13 | 39.12,1.96 C7.2 38.94,2.13 | 40.54,3.56 L1.2 | 33.6,15.65 U2.4 | v33.94,1.78 34.65,1.78 U1.1 | 35.72,3.2 U1.4 | 37.87,2.13 37.69,2.13 C24.1 37.87,2.13
  Top 0.254: U2.20 U2.19
  Top 0.305: 33.6,15.65 34.65,15.65 35.75,14.63 35.75,13.85 v36.1,13.4
  Top 0.406: 37.87,4.98 LED4.A 37.87,4.8 | 37.87,6.22 LED5.A 37.95,6.7 | v38.79,8.9 38.79,11.72 39.57,12.42 U2.20
  Top 0.61: 39.12,1.96 40.36,1.96 | 37.87,6.22 37.87,4.98 | 40.54,2.13 40.54,3.56 | v38.79,8.9 38.79,7.65 37.95,6.7 | 38.94,2.13 37.87,2.13 37.87,3.2 | 37.87,4.8 37.87,3.2 | 37.87,3.2 35.72,3.2
  Bottom 0.178: v33.94,1.78 38.74,6.58 38.74,8.89 v38.79,8.9
  Bottom 0.305: v36.1,13.4 36.1,11.59 v38.79,8.9